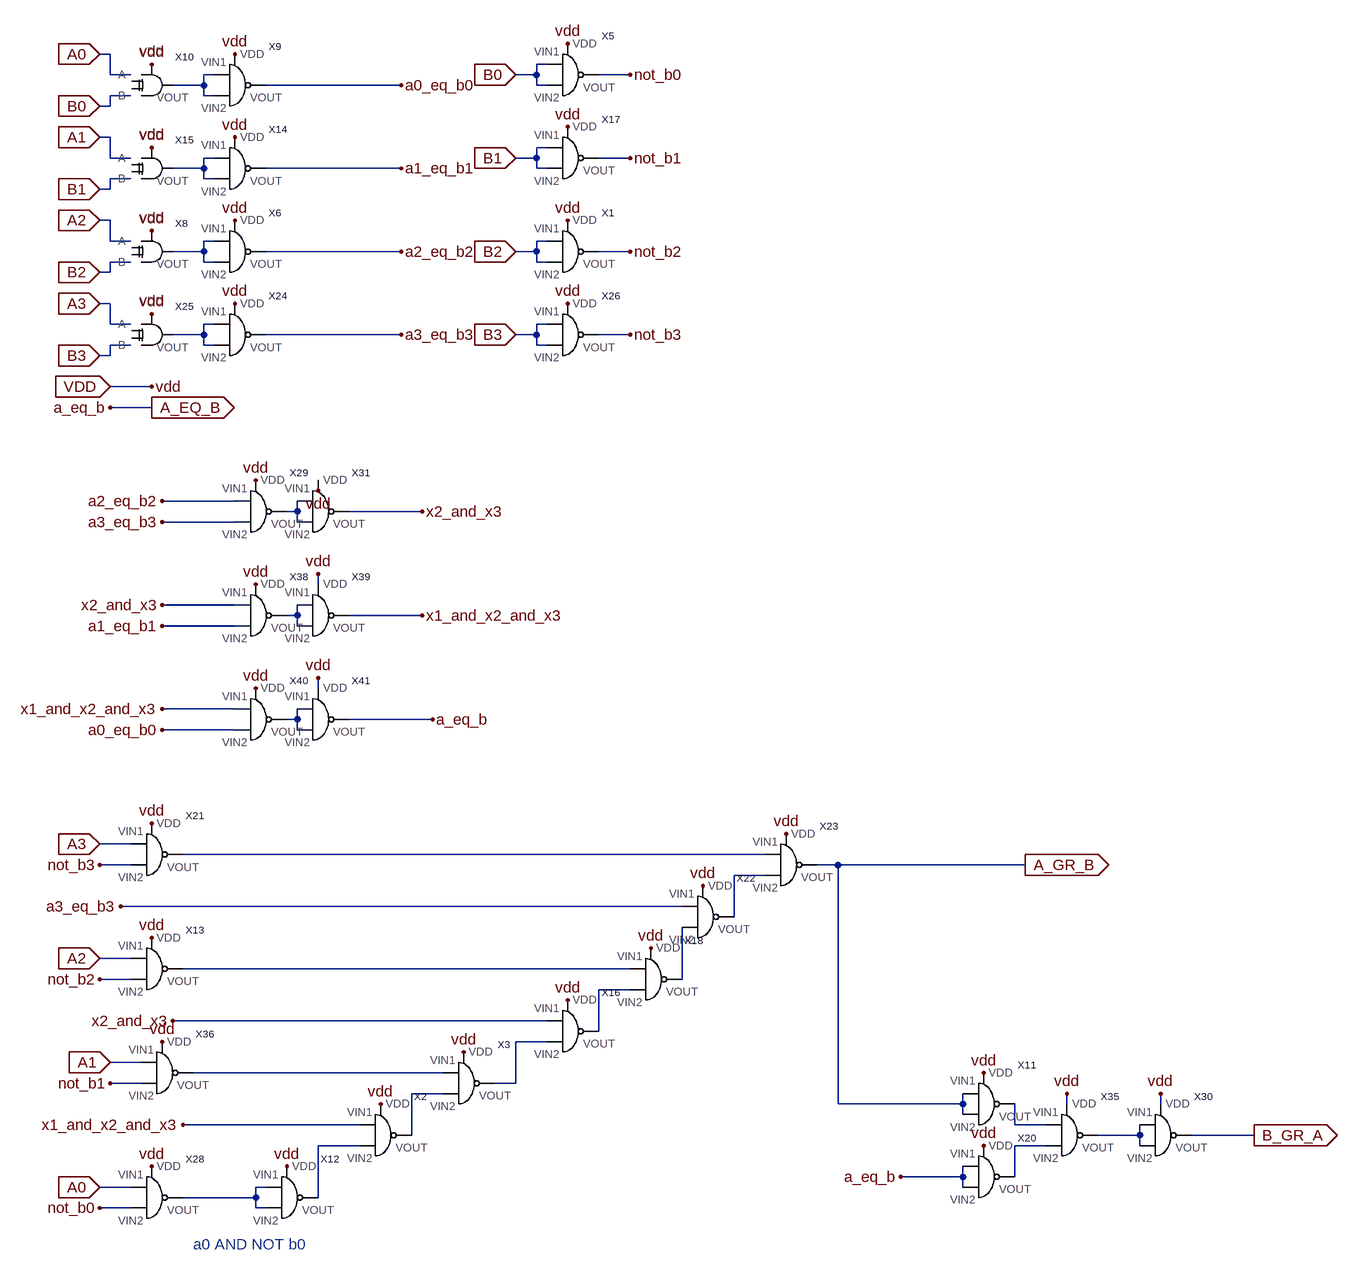
[diagram p0: schematic comp4.asc]
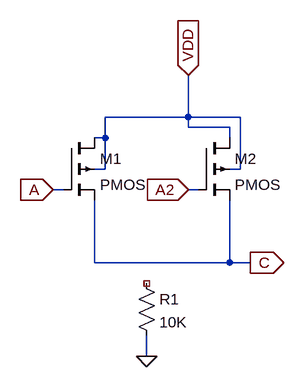
[diagram p1: sub-circuit nand.asc]
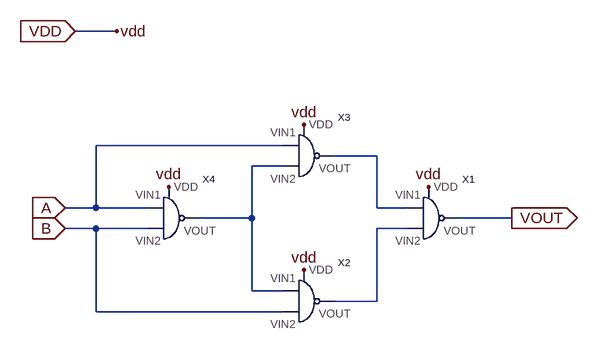
[diagram p2: sub-circuit xor.asc]
comp4.asc, the LTspice schematic file:
Version 4
SHEET 1 1564 1592
WIRE -784 -944 -800 -944
WIRE -112 -928 -128 -928
WIRE -784 -912 -784 -944
WIRE -752 -912 -784 -912
WIRE -624 -912 -640 -912
WIRE -128 -912 -128 -928
WIRE -128 -912 -160 -912
WIRE 16 -912 -32 -912
WIRE -640 -896 -640 -912
WIRE -640 -896 -688 -896
WIRE -336 -896 -544 -896
WIRE -128 -896 -128 -912
WIRE -112 -896 -128 -896
WIRE -752 -880 -784 -880
WIRE -640 -880 -640 -896
WIRE -624 -880 -640 -880
WIRE -784 -864 -784 -880
WIRE -784 -864 -800 -864
WIRE -784 -816 -800 -816
WIRE -112 -800 -128 -800
WIRE -784 -784 -784 -816
WIRE -752 -784 -784 -784
WIRE -624 -784 -640 -784
WIRE -128 -784 -128 -800
WIRE -128 -784 -160 -784
WIRE 16 -784 -32 -784
WIRE -640 -768 -640 -784
WIRE -640 -768 -688 -768
WIRE -336 -768 -544 -768
WIRE -128 -768 -128 -784
WIRE -112 -768 -128 -768
WIRE -752 -752 -784 -752
WIRE -640 -752 -640 -768
WIRE -624 -752 -640 -752
WIRE -784 -736 -784 -752
WIRE -784 -736 -800 -736
WIRE -784 -688 -800 -688
WIRE -784 -656 -784 -688
WIRE -752 -656 -784 -656
WIRE -624 -656 -640 -656
WIRE -112 -656 -128 -656
WIRE -640 -640 -640 -656
WIRE -640 -640 -688 -640
WIRE -336 -640 -544 -640
WIRE -128 -640 -128 -656
WIRE -128 -640 -160 -640
WIRE 16 -640 -32 -640
WIRE -752 -624 -784 -624
WIRE -640 -624 -640 -640
WIRE -624 -624 -640 -624
WIRE -128 -624 -128 -640
WIRE -112 -624 -128 -624
WIRE -784 -608 -784 -624
WIRE -784 -608 -800 -608
WIRE -784 -560 -800 -560
WIRE -784 -528 -784 -560
WIRE -752 -528 -784 -528
WIRE -624 -528 -640 -528
WIRE -112 -528 -128 -528
WIRE -640 -512 -640 -528
WIRE -640 -512 -688 -512
WIRE -336 -512 -544 -512
WIRE -128 -512 -128 -528
WIRE -128 -512 -160 -512
WIRE 16 -512 -32 -512
WIRE -752 -496 -784 -496
WIRE -640 -496 -640 -512
WIRE -624 -496 -640 -496
WIRE -128 -496 -128 -512
WIRE -112 -496 -128 -496
WIRE -784 -480 -784 -496
WIRE -784 -480 -800 -480
WIRE -720 -432 -784 -432
WIRE -720 -400 -784 -400
WIRE -464 -272 -464 -288
WIRE -592 -256 -704 -256
WIRE -496 -240 -496 -256
WIRE -496 -240 -512 -240
WIRE -304 -240 -416 -240
WIRE -592 -224 -704 -224
WIRE -496 -224 -496 -240
WIRE -464 -128 -464 -144
WIRE -592 -96 -704 -96
WIRE -496 -80 -496 -96
WIRE -496 -80 -512 -80
WIRE -304 -80 -416 -80
WIRE -592 -64 -704 -64
WIRE -496 -64 -496 -80
WIRE -464 32 -464 16
WIRE -592 64 -704 64
WIRE -496 80 -496 64
WIRE -496 80 -512 80
WIRE -288 80 -416 80
WIRE -592 96 -704 96
WIRE -496 96 -496 80
WIRE -752 272 -800 272
WIRE 224 288 -672 288
WIRE -752 304 -800 304
WIRE 336 304 304 304
WIRE 624 304 336 304
WIRE 224 320 176 320
WIRE 96 368 -768 368
WIRE 176 384 176 320
WIRE -752 448 -800 448
WIRE 16 464 -672 464
WIRE -752 480 -800 480
WIRE 96 480 96 400
WIRE 16 496 -32 496
WIRE -112 544 -688 544
WIRE -32 560 -32 496
WIRE -112 576 -160 576
WIRE -736 608 -784 608
WIRE -272 624 -656 624
WIRE -736 640 -784 640
WIRE -160 640 -160 576
WIRE -160 640 -192 640
WIRE -272 656 -320 656
WIRE 336 672 336 304
WIRE 528 672 528 656
WIRE 528 672 336 672
WIRE 688 672 688 656
WIRE 832 672 832 656
WIRE 528 688 528 672
WIRE -400 704 -672 704
WIRE 608 704 608 672
WIRE 656 704 608 704
WIRE -320 720 -320 656
WIRE 800 720 800 704
WIRE 800 720 736 720
WIRE 976 720 880 720
WIRE -400 736 -464 736
WIRE 656 736 608 736
WIRE 800 736 800 720
WIRE 528 784 528 768
WIRE 528 784 432 784
WIRE 608 784 608 736
WIRE -752 800 -800 800
WIRE -544 800 -560 800
WIRE 528 800 528 784
WIRE -560 816 -560 800
WIRE -560 816 -672 816
WIRE -464 816 -464 736
WIRE -752 832 -800 832
WIRE -560 832 -560 816
WIRE -544 832 -560 832
FLAG 16 -912 not_b0
FLAG -160 -912 B0
IOPIN -160 -912 In
FLAG -80 -960 vdd
FLAG -336 -896 a0_eq_b0
FLAG -800 -944 A0
IOPIN -800 -944 In
FLAG -592 -944 vdd
FLAG -800 -864 B0
IOPIN -800 -864 In
FLAG -720 -928 vdd
FLAG -336 -768 a1_eq_b1
FLAG -800 -816 A1
IOPIN -800 -816 In
FLAG -592 -816 vdd
FLAG -800 -736 B1
IOPIN -800 -736 In
FLAG -720 -800 vdd
FLAG 16 -784 not_b1
FLAG -160 -784 B1
IOPIN -160 -784 In
FLAG -512 768 vdd
FLAG -368 672 vdd
FLAG -240 592 vdd
FLAG 16 -640 not_b2
FLAG -160 -640 B2
IOPIN -160 -640 In
FLAG -336 -640 a2_eq_b2
FLAG -800 -688 A2
IOPIN -800 -688 In
FLAG -592 -688 vdd
FLAG -800 -608 B2
IOPIN -800 -608 In
FLAG -720 -672 vdd
FLAG -800 448 A2
IOPIN -800 448 In
FLAG -800 480 not_b2
FLAG -720 416 vdd
FLAG -80 512 vdd
FLAG 48 432 vdd
FLAG -800 272 A3
IOPIN -800 272 In
FLAG -800 304 not_b3
FLAG -720 240 vdd
FLAG -768 368 a3_eq_b3
FLAG 128 336 vdd
FLAG 256 256 vdd
FLAG -336 -512 a3_eq_b3
FLAG -800 -560 A3
IOPIN -800 -560 In
FLAG -592 -560 vdd
FLAG -800 -480 B3
IOPIN -800 -480 In
FLAG -720 -544 vdd
FLAG 16 -512 not_b3
FLAG -160 -512 B3
IOPIN -160 -512 In
FLAG -80 -560 vdd
FLAG -800 800 A0
IOPIN -800 800 In
FLAG -800 832 not_b0
FLAG -720 768 vdd
FLAG -704 -256 a2_eq_b2
FLAG -704 -224 a3_eq_b3
FLAG -560 -288 vdd
FLAG -464 -272 vdd
FLAG 624 304 A_GR_B
IOPIN 624 304 Out
FLAG 976 720 B_GR_A
IOPIN 976 720 Out
FLAG -784 -432 VDD
IOPIN -784 -432 In
FLAG -720 -432 vdd
FLAG -784 608 A1
IOPIN -784 608 In
FLAG -784 640 not_b1
FLAG -704 576 vdd
FLAG -304 -240 x2_and_x3
FLAG -704 -64 a1_eq_b1
FLAG -560 -128 vdd
FLAG -464 -144 vdd
FLAG -704 -96 x2_and_x3
FLAG -304 -80 x1_and_x2_and_x3
FLAG -704 96 a0_eq_b0
FLAG -560 32 vdd
FLAG -464 16 vdd
FLAG -704 64 x1_and_x2_and_x3
FLAG -688 544 x2_and_x3
FLAG -672 704 x1_and_x2_and_x3
FLAG -720 -400 A_EQ_B
IOPIN -720 -400 Out
FLAG -288 80 a_eq_b
FLAG -784 -400 a_eq_b
FLAG 560 624 vdd
FLAG 560 736 vdd
FLAG 432 784 a_eq_b
FLAG 688 656 vdd
FLAG 832 656 vdd
FLAG -80 -832 vdd
FLAG -80 -688 vdd
SYMBOL nand -368 720 R0
SYMATTR InstName X2
SYMBOL nand -240 640 R0
SYMATTR InstName X3
SYMBOL nand -80 -912 R0
SYMATTR InstName X5
SYMBOL nand -592 -896 R0
SYMATTR InstName X9
SYMBOL xor -720 -896 R0
SYMATTR InstName X10
SYMBOL nand -512 816 R0
SYMATTR InstName X12
SYMBOL nand -592 -768 R0
SYMATTR InstName X14
SYMBOL xor -720 -768 R0
SYMATTR InstName X15
SYMBOL nand -80 -784 R0
SYMATTR InstName X17
SYMBOL nand -80 -640 R0
SYMATTR InstName X1
SYMBOL nand -592 -640 R0
SYMATTR InstName X6
SYMBOL xor -720 -640 R0
SYMATTR InstName X8
SYMBOL nand -720 464 R0
SYMATTR InstName X13
SYMBOL nand -80 560 R0
SYMATTR InstName X16
SYMBOL nand 48 480 R0
SYMATTR InstName X18
SYMBOL nand -720 288 R0
SYMATTR InstName X21
SYMBOL nand 128 384 R0
SYMATTR InstName X22
SYMBOL nand 256 304 R0
SYMATTR InstName X23
SYMBOL nand -592 -512 R0
SYMATTR InstName X24
SYMBOL xor -720 -512 R0
SYMATTR InstName X25
SYMBOL nand -80 -512 R0
SYMATTR InstName X26
SYMBOL nand -720 816 R0
SYMATTR InstName X28
SYMBOL nand -560 -240 R0
SYMATTR InstName X29
SYMBOL nand -464 -240 R0
SYMATTR InstName X31
SYMBOL nand 688 720 R0
SYMATTR InstName X35
SYMBOL nand -704 624 R0
SYMATTR InstName X36
SYMBOL nand -560 -80 R0
SYMATTR InstName X38
SYMBOL nand -464 -80 R0
SYMATTR InstName X39
SYMBOL nand -560 80 R0
SYMATTR InstName X40
SYMBOL nand -464 80 R0
SYMATTR InstName X41
SYMBOL nand 560 672 R0
SYMATTR InstName X11
SYMBOL nand 560 784 R0
SYMATTR InstName X20
SYMBOL nand 832 720 R0
SYMATTR InstName X30
TEXT -656 888 Left 2 ;a0 AND NOT b0

nand.asc, the sub-circuit schematic file:
Version 4
SHEET 1 880 680
WIRE 256 80 256 16
WIRE 256 80 128 80
WIRE 336 80 256 80
WIRE 256 96 256 80
WIRE 320 96 256 96
WIRE 128 112 128 80
WIRE 128 112 112 112
WIRE 320 112 320 96
WIRE 128 160 128 112
WIRE 128 160 112 160
WIRE 336 160 336 80
WIRE 336 160 320 160
WIRE 64 192 48 192
WIRE 272 192 256 192
WIRE 112 304 112 208
WIRE 320 304 112 304
WIRE 320 304 320 208
WIRE 352 304 320 304
WIRE 192 448 192 416
FLAG 48 192 A
IOPIN 48 192 In
FLAG 256 192 A2
IOPIN 256 192 In
FLAG 192 448 0
FLAG 352 304 C
IOPIN 352 304 Out
FLAG 256 16 VDD
IOPIN 256 16 In
SYMBOL pmos4 64 112 R0
SYMATTR InstName M1
SYMBOL pmos4 272 112 R0
SYMATTR InstName M2
SYMBOL res 176 320 R0
SYMATTR InstName R1
SYMATTR Value 10K

xor.asc, the sub-circuit schematic file:
Version 4
SHEET 1 880 680
WIRE -304 -176 -368 -176
WIRE -48 0 -336 0
WIRE 96 16 32 16
WIRE -48 32 -96 32
WIRE -336 96 -336 0
WIRE -336 96 -384 96
WIRE -256 96 -336 96
WIRE 96 96 96 16
WIRE 144 96 96 96
WIRE -96 112 -96 32
WIRE -96 112 -176 112
WIRE 304 112 224 112
WIRE -336 128 -384 128
WIRE -256 128 -336 128
WIRE 144 128 96 128
WIRE -96 224 -96 112
WIRE -48 224 -96 224
WIRE 96 240 96 128
WIRE 96 240 32 240
WIRE -336 256 -336 128
WIRE -48 256 -336 256
FLAG -384 96 A
IOPIN -384 96 In
FLAG -384 128 B
IOPIN -384 128 In
FLAG -368 -176 VDD
IOPIN -368 -176 In
FLAG -304 -176 vdd
FLAG -16 -32 vdd
FLAG -224 64 vdd
FLAG -16 192 vdd
FLAG 176 64 vdd
FLAG 304 112 VOUT
IOPIN 304 112 Out
SYMBOL nand 176 112 R0
SYMATTR InstName X1
SYMBOL nand -16 240 R0
SYMATTR InstName X2
SYMBOL nand -16 16 R0
SYMATTR InstName X3
SYMBOL nand -224 112 R0
SYMATTR InstName X4

The netlist it stands for:
* comp4.asc
XX2 x1_and_x2_and_x3 N018 N015 vdd nand
XX3 N014 N015 N013 vdd nand
XX5 B0 B0 not_b0 vdd nand
XX9 N001 N001 a0_eq_b0 vdd nand
XX10 A0 B0 N001 vdd xor
XX12 N020 N020 N018 vdd nand
XX14 N002 N002 a1_eq_b1 vdd nand
XX15 A1 B1 N002 vdd xor
XX17 B1 B1 not_b1 vdd nand
XX1 B2 B2 not_b2 vdd nand
XX6 N003 N003 a2_eq_b2 vdd nand
XX8 A2 B2 N003 vdd xor
XX13 A2 not_b2 N010 vdd nand
XX16 x2_and_x3 N013 N012 vdd nand
XX18 N010 N012 N011 vdd nand
XX21 A3 not_b3 N008 vdd nand
XX22 a3_eq_b3 N011 N009 vdd nand
XX23 N008 N009 A_GR_B vdd nand
XX24 N004 N004 a3_eq_b3 vdd nand
XX25 A3 B3 N004 vdd xor
XX26 B3 B3 not_b3 vdd nand
XX28 A0 not_b0 N020 vdd nand
XX29 a2_eq_b2 a3_eq_b3 N005 vdd nand
XX31 N005 N005 x2_and_x3 vdd nand
XX35 N016 N019 N017 vdd nand
XX36 A1 not_b1 N014 vdd nand
XX38 x2_and_x3 a1_eq_b1 N006 vdd nand
XX39 N006 N006 x1_and_x2_and_x3 vdd nand
XX40 x1_and_x2_and_x3 a0_eq_b0 N007 vdd nand
XX41 N007 N007 A_EQ_B vdd nand
XX11 A_GR_B A_GR_B N016 vdd nand
XX20 A_EQ_B A_EQ_B N019 vdd nand
XX30 N017 N017 B_GR_A vdd nand

* block symbol definitions
.subckt nand VIN1 VIN2 VOUT VDD
M1 VDD A C VDD PMOS
M2 VDD A2 C VDD PMOS
R1 NC_01 0 10K
.ends nand

.subckt xor A B VOUT VDD
XX1 N001 N003 VOUT VDD nand
XX2 N002 B N003 VDD nand
XX3 A N002 N001 VDD nand
XX4 A B N002 VDD nand
.ends xor

.model NMOS NMOS
.model PMOS PMOS
.lib standard.mos
* a0 AND NOT b0
.backanno
.end